# Altium schematic sheet SHT_9_X32-mikroBUS_07349-R5_L10.SchDoc
size B; CompanyName: Microchip Technology Inc.; Organization: Microchip Technology; Address1: 2355 West Chandler Blvd.; Address2: Chandler, AZ  85224; Address4: USA; SheetNumber: 9; SheetTotal: 9; SheetTitle: X32 and mikroBUS Connectors; Time: Time
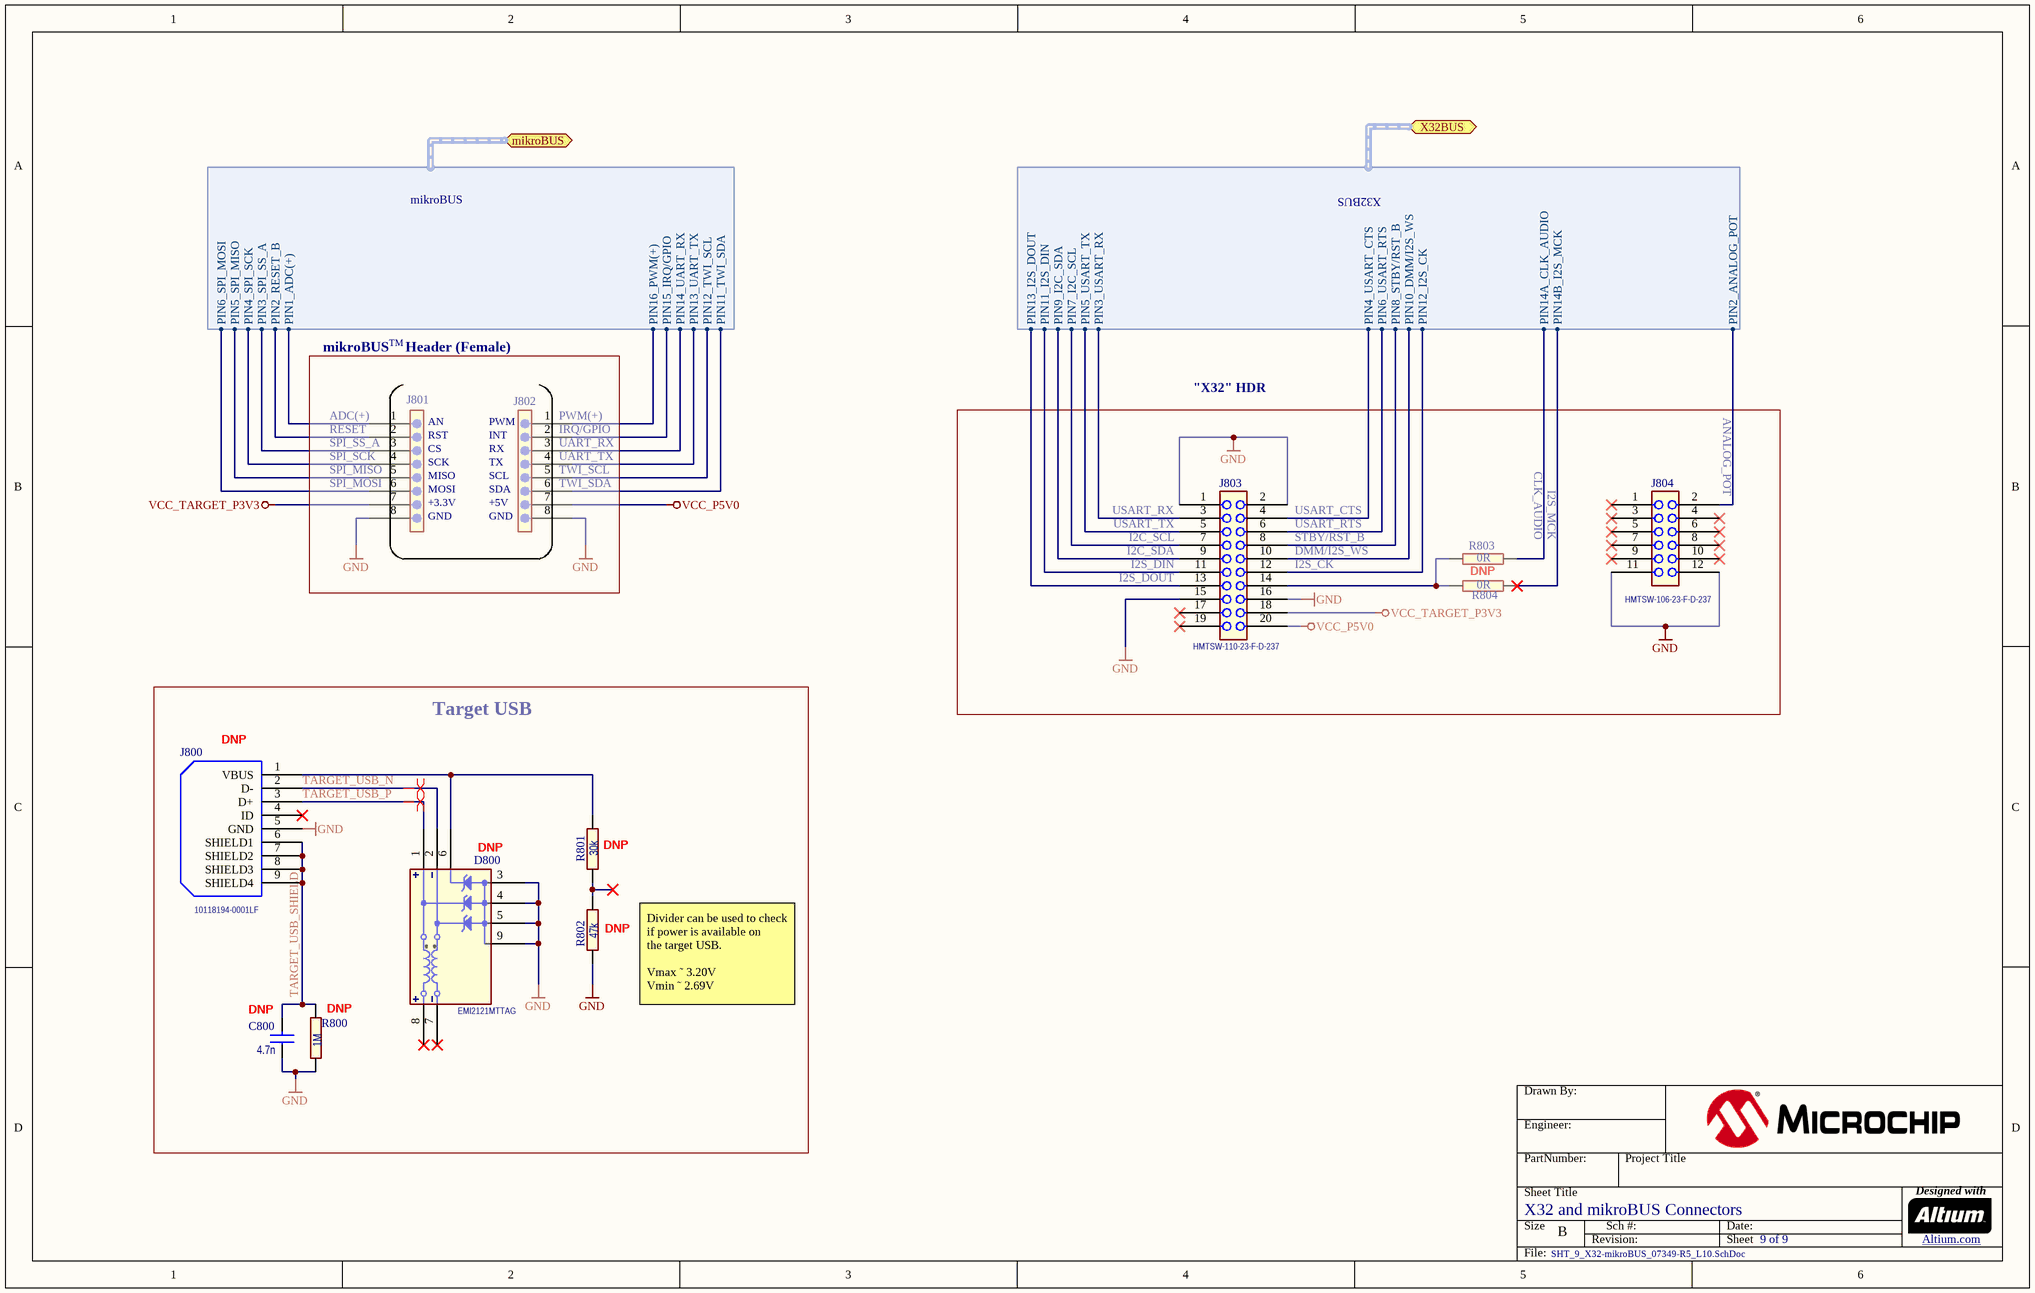
[diagram p0: SHT_9_X32-mikroBUS_07349-R5_L10.SchDoc]

## Parts
?  (no value)  (graphical)
C800  value 4.7n  Placement: DNP  [AP1-00053]
D800  value EMI2121MTTAG  Placement: DNP  [AP4-00159]  (hidden comment: WDFN8)
J800  MPN: 10118194-0001LF  Placement: DNP  [AP8-01117]  (hidden comment: USB_AB)
J801  HEADER 1x8 FEMALE  [AP8-00823]  (value not drawn)
J802  HEADER 1x8 FEMALE  [AP8-00823]  (value not drawn)
J803  value HMTSW-110-23-F-D-237  [AP8-00744]  (hidden comment: Same as A08-1514 but with 1mm hole)
J804  value HMTSW-106-23-F-D-237  [AP8-00809]  (hidden comment: HEADER 2x6)
R800  value 1M  Placement: DNP  [AP2-00011]
R801  value 30k  Placement: DNP  [AP2-00011]
R802  value 47k  Placement: DNP  [AP2-00011]
R803  value 0R  [AP2-00000]
R804  value 0R  Placement: DNP  [AP2-00000]

## Blocks framed on the sheet
"X32" HDR: J803 J804 R803 R804
Target USB: C800 D800 J800 R800-R802

## Ports
mikroBUS (harness mikroBUS), X32BUS (harness X32BUS)

## Harnesses
mikroBUS: PIN6_SPI_MOSI, PIN5_SPI_MISO, PIN4_SPI_SCK, PIN3_SPI_SS_A, PIN2_RESET_B, PIN1_ADC(+), PIN16_PWM(+), PIN15_IRQ/GPIO, PIN14_UART_RX, PIN13_UART_TX, PIN12_TWI_SCL, PIN11_TWI_SDA
X32BUS: PIN3_USART_RX, PIN5_USART_TX, PIN14A_CLK_AUDIO, PIN4_USART_CTS, PIN12_I2S_CK, PIN6_USART_RTS, PIN9_I2C_SDA, PIN7_I2C_SCL, PIN8_STBY/RST_B, PIN11_I2S_DIN, PIN13_I2S_DOUT, PIN10_DMM/I2S_WS, PIN14B_I2S_MCK, PIN2_ANALOG_POT

## Nets
GND: C800.1 D800.3(GND) D800.4(GND) D800.5(GND) D800.9(GND) J800.5(GND) J801.8 J802.8 J803.1 J803.2 J803.15 J803.16 J804.11 J804.12 R800.1 R802.1
VCC_P5V0: J802.7 J803.20
VCC_TARGET_P3V3: J801.7 J803.18
TARGET_USB_N: D800.2(DIFF2_EXT) J800.2(D-)
TARGET_USB_P: D800.1(DIFF1_EXT) J800.3(D+)
TARGET_USB_SHIELD: C800.2 J800.6(SHIELD1) J800.7(SHIELD2) J800.8(SHIELD3) J800.9(SHIELD4) R800.2
NetD800_6: D800.6(VBUS) J800.1(VBUS) R801.2
NetJ801_1: J801.1 ; port mikroBUS.PIN1_ADC(+)
NetJ801_2: J801.2 ; port mikroBUS.PIN2_RESET_B
NetJ801_3: J801.3 ; port mikroBUS.PIN3_SPI_SS_A
NetJ801_4: J801.4 ; port mikroBUS.PIN4_SPI_SCK
NetJ801_5: J801.5 ; port mikroBUS.PIN5_SPI_MISO
NetJ801_6: J801.6 ; port mikroBUS.PIN6_SPI_MOSI
NetJ802_1: J802.1 ; port mikroBUS.PIN16_PWM(+)
NetJ802_2: J802.2 ; port mikroBUS.PIN15_IRQ/GPIO
NetJ802_3: J802.3 ; port mikroBUS.PIN14_UART_RX
NetJ802_4: J802.4 ; port mikroBUS.PIN13_UART_TX
NetJ802_5: J802.5 ; port mikroBUS.PIN12_TWI_SCL
NetJ802_6: J802.6 ; port mikroBUS.PIN11_TWI_SDA
NetJ803_3: J803.3 ; port X32BUS.PIN3_USART_RX
NetJ803_4: J803.4 ; port X32BUS.PIN4_USART_CTS
NetJ803_5: J803.5 ; port X32BUS.PIN5_USART_TX
NetJ803_6: J803.6 ; port X32BUS.PIN6_USART_RTS
NetJ803_7: J803.7 ; port X32BUS.PIN7_I2C_SCL
NetJ803_8: J803.8 ; port X32BUS.PIN8_STBY/RST_B
NetJ803_9: J803.9 ; port X32BUS.PIN9_I2C_SDA
NetJ803_10: J803.10 ; port X32BUS.PIN10_DMM/I2S_WS
NetJ803_11: J803.11 ; port X32BUS.PIN11_I2S_DIN
NetJ803_12: J803.12 ; port X32BUS.PIN12_I2S_CK
NetJ803_13: J803.13 ; port X32BUS.PIN13_I2S_DOUT
NetJ803_14: J803.14 R803.2 R804.2
NetJ804_2: J804.2 ; port X32BUS.PIN2_ANALOG_POT
NetR801_1: R801.1 R802.2
NetR803_1: R803.1 ; port X32BUS.PIN14A_CLK_AUDIO
NetR804_1: R804.1 ; port X32BUS.PIN14B_I2S_MCK

Not connected (* = marked no-connect by the designer): D800 7(DIFF2_INT)* 8(DIFF1_INT)*; J800 4(ID)*; J803 17* 19*; J804 1* 3* 4* 5* 6* 7* 8* 9* 10*

## Layout directives
differential pair; rule Assembly Testpoint Usage [Testpoint - Not Allowed    Multiple - Not Allowed]: TARGET_USB_N, TARGET_USB_P

## Notes on the sheet
- mikroBUS
- TM
- Header (Female)
- (near J801) ADC(+)
- (near J801) RESET
- (near J801) AN
- (near J801) RST
- (near J802) PWM
- (near J802) INT
- (near J802) PWM(+)
- (near J802) IRQ/GPIO
- (near J804) ANALOG_POT
- (near J801) SPI_SS_A
- (near J801) SPI_MISO
- (near J801) SPI_MOSI
- (near J801) SPI_SCK
- (near J801) CS
- (near J801) SCK
- (near J801) MISO
- (near J801) MOSI
- (near J801) +3.3V
- (near J802) RX
- (near J802) TX
- (near J802) SCL
- (near J802) SDA
- (near J802) +5V
- (near J802) TWI_SDA
- (near J802) UART_RX
- (near J802) TWI_SCL
- (near J802) UART_TX
- CLK_AUDIO
- I2S_MCK
- (near J801) GND
- (near J802) GND
- USART_RX
- USART_TX
- (near J803) I2C_SDA
- (near J803) I2C_SCL
- (near J803) I2S_DIN
- (near J803) USART_CTS
- (near J803) USART_RTS
- (near J803) STBY/RST_B
- (near J803) DMM/I2S_WS
- (near J803) I2S_CK
- (near J803) I2S_DOUT
- Divider can be used to check
  if power is available on
  the target USB.
  Vmax ˜ 3.20V
  Vmin ˜ 2.69V
- Drawn By:
- Engineer:
- PartNumber:
- Project Title
- Sheet Title
- Size
- B
- Revision:
- Sch #:
- Date:
- Sheet
- Designed with
- Altium.com <http://go.altium.com/MicrochipLandingPage_Evaluation.html>
- File:

## Library data of the parts
? = Title Block B
C800 = A01-0046: Ceramic capacitor, SMD 0402, X7R, 25V, +/-10% (de35287); PartGroup: Capacitors,Ceramic,SMD 0402; Manufacturer: PHYCOMP; MPN: 2238 587 15632; TemperatureRange: -55 - +125 deg C; ComponentStatus: 'Active (verified)'; Status: Active; Verified by: Lars Helge Mo; Verified date: 2005-12-15; AN: A01-0046; Tolerance: 25V, +/-10%; Height: 0.550000011920929; FootprintStatus: 'Active (Verified)'
D800 = A04-0195: EMI2121, SZEMI2121 Single Pair Common Mode Filter with ESD Protection; PartGroup: Diodes,Transient suppression; Manufacturer: ON Semiconductor; TemperatureRange: âˆ’40 to +85 Â°C; ComponentStatus: 'Active (verified)'; AN: A04-0195; Height: 0.800000011920929; MPN: EMI2121MTTAG; FootprintStatus: 'Active (Verified)'
J800 = A08-2885: micro B USB 2.0 Receptacle Connector 5 Position Surface Mount, Right Angle; Through Hole; PartGroup: Mechanical devices,Connectors,USB; Manufacturer: Amphenol; Value: CONN USB MICRO B RECPT SMT R/A; ComponentStatus: 'Active (verified)'; Verified date: 2006-05-18; Verified by: Eirik Rasmussen; Status: Active; AN: A08-2885; Height: 2.40000009536743; FootprintStatus: 'Active (Verified)'
J801 J802 = A08-2147: PINREX, 2.54mm 1x8 Female Header Straight, THM, H=8.5mm, Gold Flash, Black Insulator; PartGroup: Mechanical devices,Connectors,Pin header receptacle; Manufacturer: PINREX TECHNOLOGY CORP.; Value: 610-91-08GB00; TemperatureRange: -40Â° to +105Â° C; ComponentStatus: 'Active (verified)'; Status: New; AN: A08-2147; Height: 8.5; MPN: 610-91-08GB00; FootprintStatus: 'Active (Verified)'
J803 = A08-1801: 2x10 pin header, 2.54mm pitch, Pin-in-Paste THM, 1mm hole; PartGroup: Mechanical devices,Connectors,Pin headers; Manufacturer: SAMTEC; ComponentStatus: 'Active (verified)'; Status: Active; Verified by: Lars Helge Mo; Verified date: 2005-12-19; AN: A08-1801; Height: 6.09999990463257; MPN: HMTSW-110-23-F-D-237; FootprintStatus: 'Active (Verified)'
J804 = A08-2871: 2x6 pin header, 2.54mm pitch, Pin-in-Paste, 1mm hole; PartGroup: Mechanical devices,Connectors,Pin headers; Manufacturer: SAMTEC; ComponentStatus: 'Active (verified)'; Status: New; AN: A08-2871; Height: 8.5600004196167; MPN: HMTSW-106-23-F-D-237; FootprintStatus: 'Active (Verified)'
R800 = A02-0846: Thick film resistror, SMD 0402, 1/16W, 1%; PartGroup: Resistors,SMD,0402 1%; Manufacturer: YAGEO CORP; MPN: RC0402FR-071ML; TemperatureRange: -55 to +155 deg C; ComponentStatus: 'Active (verified)'; Status: Active; Verified by: Lars Helge Mo; Verified date: 2005-12-19; AN: A02-0846; Tolerance: 1%; Height: 0.349999994039536; FootprintStatus: 'Active (Verified)'
R801 = A02-0247: Thick film resistor, SMD 0402, 1/16W, 1%; PartGroup: Resistors,SMD,0402 1%; Manufacturer: ASJ; MPN: CR10-3002-FK; TemperatureRange: -55ï¿½ to +155ï¿½C; ComponentStatus: 'Active (verified)'; Status: Active; Verified by: Lars Helge Mo; Verified date: 2005-12-19; AN: A02-0247; Tolerance: 1 %; Height: 0.349999994039536; FootprintStatus: 'Active (Verified)'
R802 = A02-0252: Thick film resistor, SMD 0402, 1/16W, 1%; PartGroup: Resistors,SMD,0402 1%; Manufacturer: KOA; MPN: RK73H1ETTP4702F; TemperatureRange: -55 - +125 deg C; ComponentStatus: 'Active (verified)'; Status: Active; Verified by: Lars Helge Mo; Verified date: 2005-12-19; AN: A02-0252; Tolerance: 1 %; Height: 0.349999994039536; FootprintStatus: 'Active (Verified)'
R803 R804 = A02-0163: RES 0.0 OHM 1/16W 0402 SMD; PartGroup: Resistors,SMD,0402 1%; Manufacturer: (n/a); MPN: RMCF0402ZT0R00; Tolerance: 1 %; TemperatureRange: -55 - +125 deg C; ComponentStatus: 'Active (verified)'; Status: Active; Verified by: Lars Helge Mo; Verified date: 2005-12-19; AN: A02-0163; Height: 0.349999994039536; FootprintStatus: 'Active (Verified)'